# EAGLE schematic Fingerprint lock (EAGLE 9.6.2)

## Sheet 1 of 2
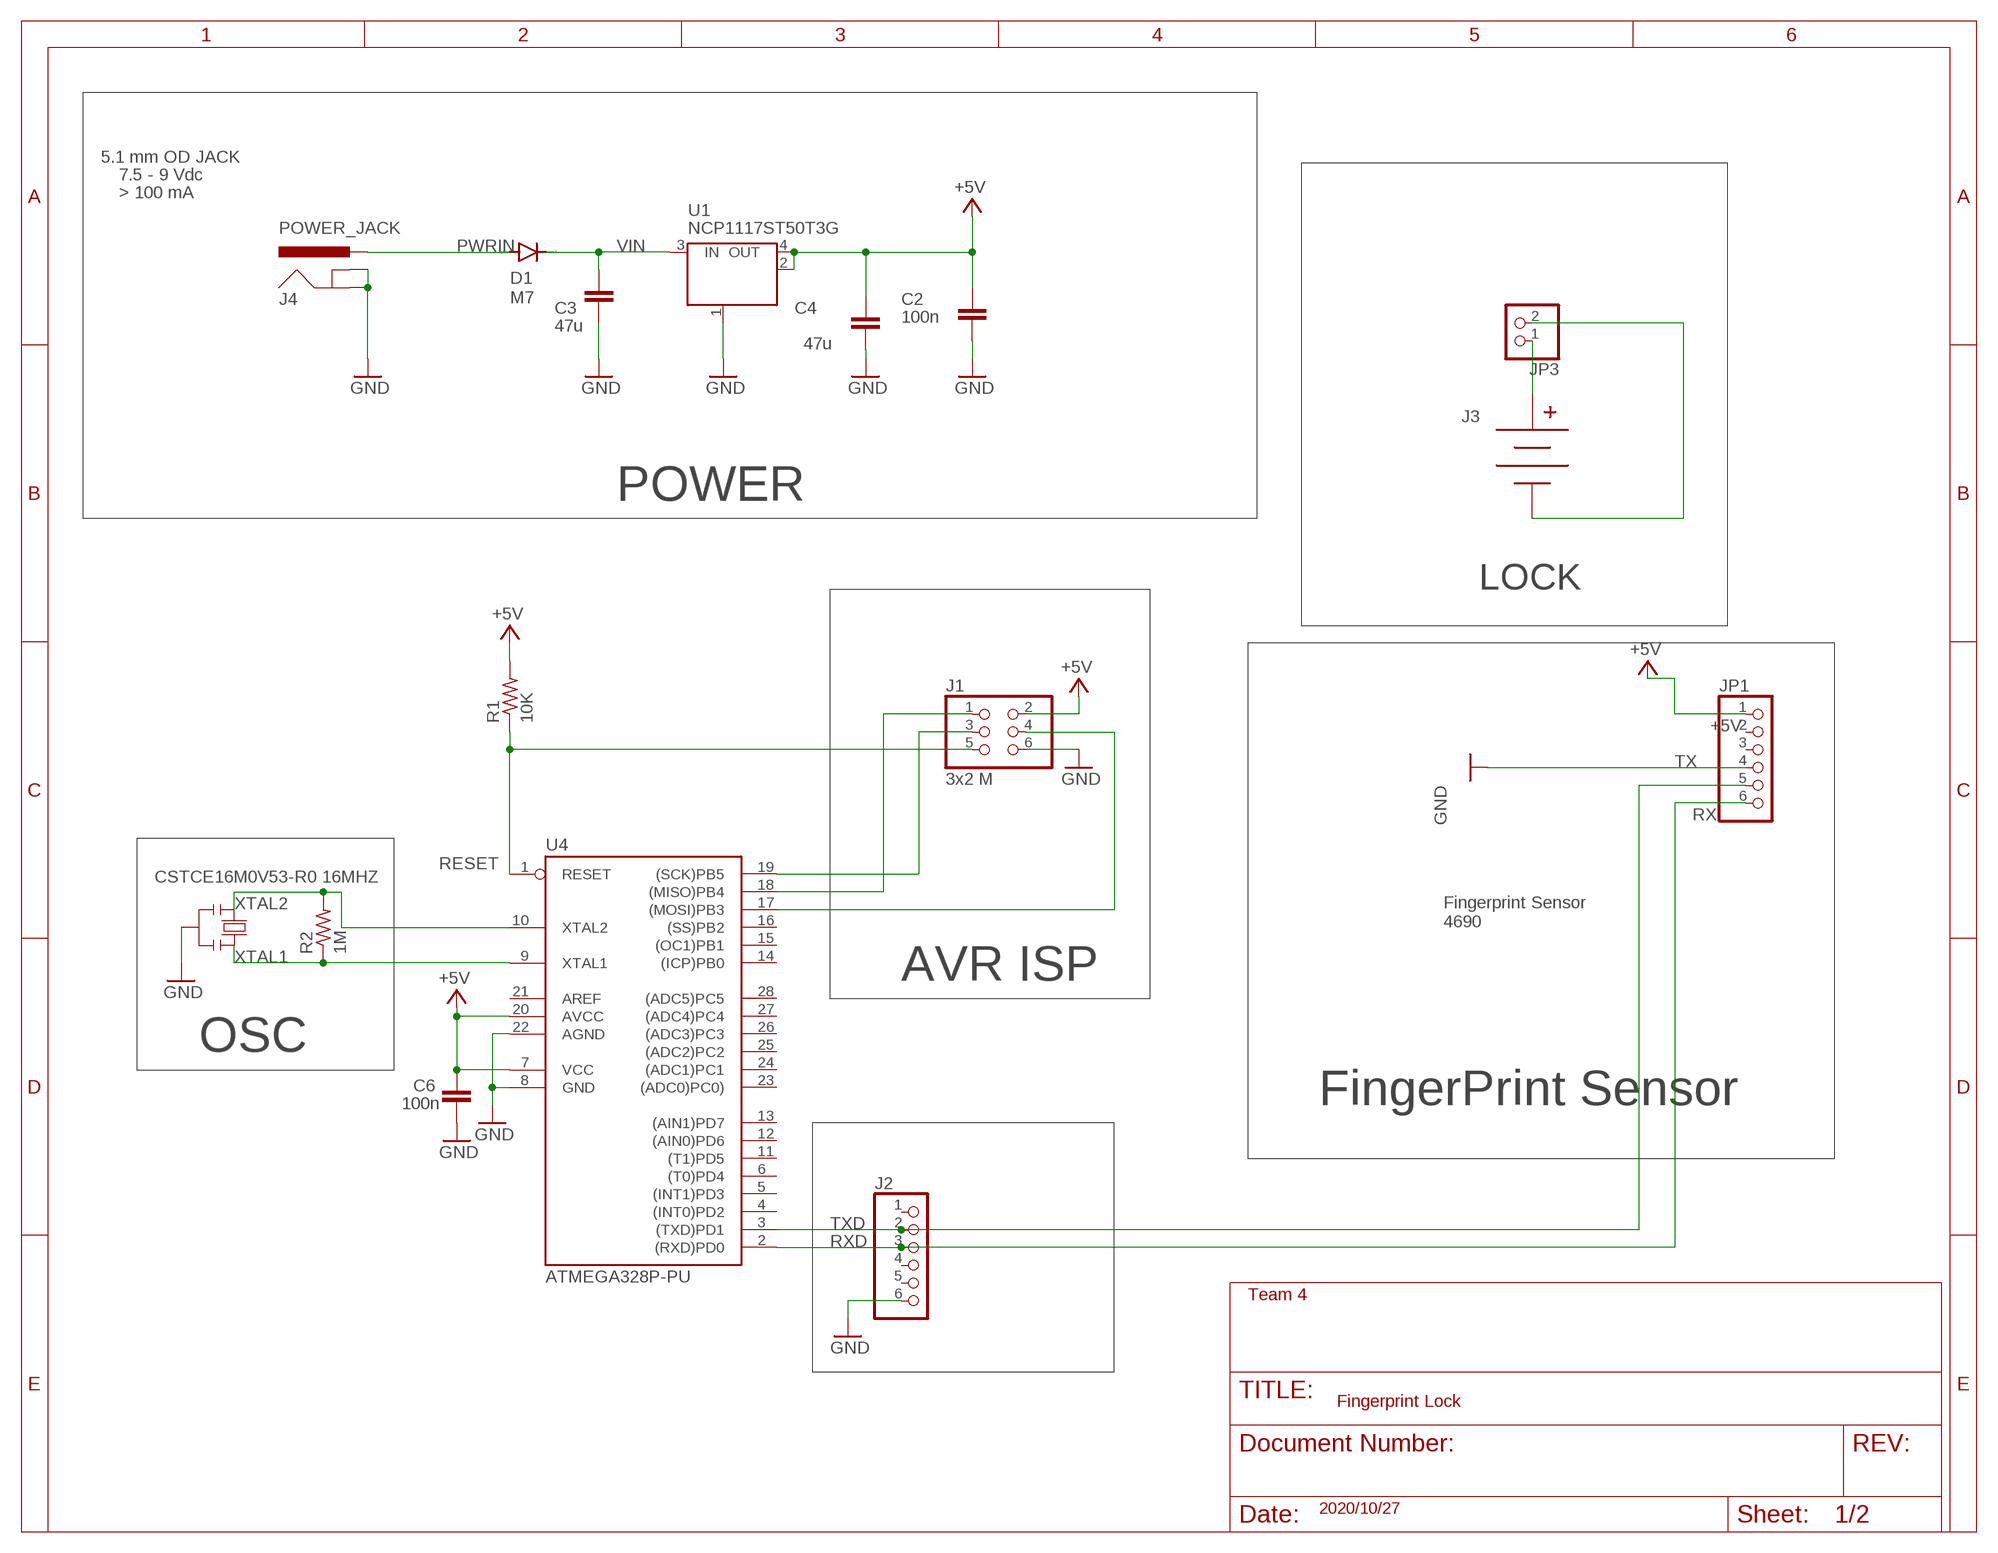
[diagram p0: schematic, sheet 1]

### Parts
C2  100n  C-EUC0805  [C0805]
C3  47u  C-EUC0805  [C0805]
C4  47u  C-EUC0805  [C0805]
C6  100n  C-EUC0805  [C0805]
D1  M7  DIODE-SMB  [SMB]
J1  3x2 M  PINHD-2X3  [2X03]
J2  PINHD-1X6  [1X06]
J3  BC9VPC  [BC9VPC]
J4  POWER_JACK  [POWER_JACK_PTH]
JP1  PINHD-1X6B  [1X06-BIG]
JP3  PINHD-1X2  [1X02]
R1  10K  R-US_R0805  [R0805]
R2  1M  R-US_R0805  [R0805]
U1  NCP1117ST50T3G  MC33269ST-3.3T3  [SOT223]
U4  ATMEGA328P-PU  [DIL28-3]
X1  CSTCE16M0V53-R0 16MHZ  RESONATORMU  [RESONATOR]

### Nets
+5V [usbvcc]: C2.2 C4.2 C6.2 J1.2 JP1.1 R1.2 U1.2(OUT) U1.4(OUT) U4.7(VCC) U4.20(AVCC)
GND [gnd]: C2.1 C3.1 C4.1 C6.1 J1.6 J2.6 J4.GND J4.GNDBREAK JP1.4 U1.1(GND/ADJ) U4.8(GND) U4.22(AGND) X1.2
MISO: J1.1 U4.18((MISO)PB4)
MOSI: J1.4 U4.17((MOSI)PB3)
N$1: J3.V+ JP3.1
N$2 [gnd]: J3.V- JP3.2
PWRIN [power]: D1.A J4.PWR
RESET: J1.5 R1.1 U4.1(RESET)
RXD: J2.3 JP1.6 U4.2((RXD)PD0)
SCK: J1.3 U4.19((SCK)PB5)
TXD: J2.2 JP1.5 U4.3((TXD)PD1)
VIN [power]: C3.2 D1.C U1.3(IN)
XTAL1: R2.1 U4.9(XTAL1) X1.3
XTAL2: R2.2 U4.10(XTAL2) X1.1
Unconnected: J2.1 J2.4 J2.5 JP1.2 JP1.3 U4.4((INT0)PD2) U4.5((INT1)PD3) U4.6((T0)PD4) U4.11((T1)PD5) U4.12((AIN0)PD6) U4.13((AIN1)PD7) U4.14((ICP)PB0) U4.15((OC1)PB1) U4.16((SS)PB2) U4.21(AREF) U4.23((ADC0)PC0)) U4.24((ADC1)PC1) U4.25((ADC2)PC2) U4.26((ADC3)PC3) U4.27((ADC4)PC4) U4.28((ADC5)PC5)

### Notes on the sheet
- 5.1 mm OD JACK
- 7.5 - 9 Vdc
- > 100 mA
- POWER
- LOCK
- TX
- RX
- Fingerprint Sensor   
  4690
- AVR ISP
- OSC
- FingerPrint Sensor
- Team 4
- Fingerprint Lock
- 2020/10/27

## Sheet 2 of 2

## Library data of the parts
C2-C4 C6 = rcl:C-EU: CAPACITOR, European symbol; SPICEPREFIX: C
D1 = diode:DIODE-: DIODE
J1 = SmartPrj:PINHD-2X3: PIN HEADER
J2 = pinhead:PINHD-1X6: PIN HEADER
J3 = SparkFun-Connectors:BC9VPC: 9V Battery Holder - PC Mount Standard and Kit footprints included SparkFun Products: SparkFun SparkPunk Sound Kit <https://www.sparkfun.com/products/11177> SparkFun SparkPunk Sequencer Kit <https://www.sparkfun.com/products/12707>; PROD_ID: BATT-10855
J4 = SparkFun-Connectors:POWER_JACK: Power Jack Connector This is the standard 5.5mm barrel jack for power. The PTH is the most common, proven, reliable, footprint. The Slot footprint only works if the mill layer is transmitted to the PCB fab house so be warned. Here are the connectors we sell at SparkFun: DC Barrel Power Jack/Connector <https://www.sparkfun.com/products/119> (PRT-00119) DC Barrel Power Jack/Connector (SMD) <https://www.sparkfun.com/products/12748> (PRT-12748) DC Barrel Jack Adapter - Breadboard Compatible <https://www.sparkfun.com/products/10811> (PRT-10811) It is used on this SparkFun product (and many, many others): SparkFun RedBoard - Programmed with Arduino <https://www.sparkfun.com/products/12757> (DEV-12757) Also, if you need a mating power supply or connector, please check these out: Wall Adapter Power Supply - 9VDC 650mA <https://www.sparkfun.com/products/298> (TOL-00298) DC Barrel Jack Adapter - Male <https://www.sparkfun.com/products/10287> (PRT-10287); PROD_ID: CONN-08197
JP1 = adafruit:PINHD-1X6: PIN HEADER
JP3 = pinhead:PINHD-1X2: PIN HEADER
R1 R2 = rcl:R-US_: RESISTOR, American symbol; SPICEPREFIX: R
U1 = linear:MC33269ST*: Adjustable Output Low Dropout Voltage Regulator 800 mA Source: http://www.onsemi.com/pub/Collateral/MC33269-D.PDF
U4 = SmartPrj:ATMEGA328P-: MICROCONTROLLER 4 Kbytes FLASH 128 bytes SRAM 256 bytes EEPROM UART 6-channel 10 bit ADC
X1 = SmartPrj:RESONATOR

## Net classes
0 default: width 0.254 mm, clearance 0.254 mm
1 power: width 0.61 mm, drill 0.61 mm, clearance 0.254 mm
2 gnd: width 0.305 mm, drill 0.559 mm, clearance 0.254 mm
3 usbvcc: width 0.508 mm, drill 0.61 mm, clearance 0.254 mm